# EAGLE design esp32-canbus (EAGLE 6.6.0)
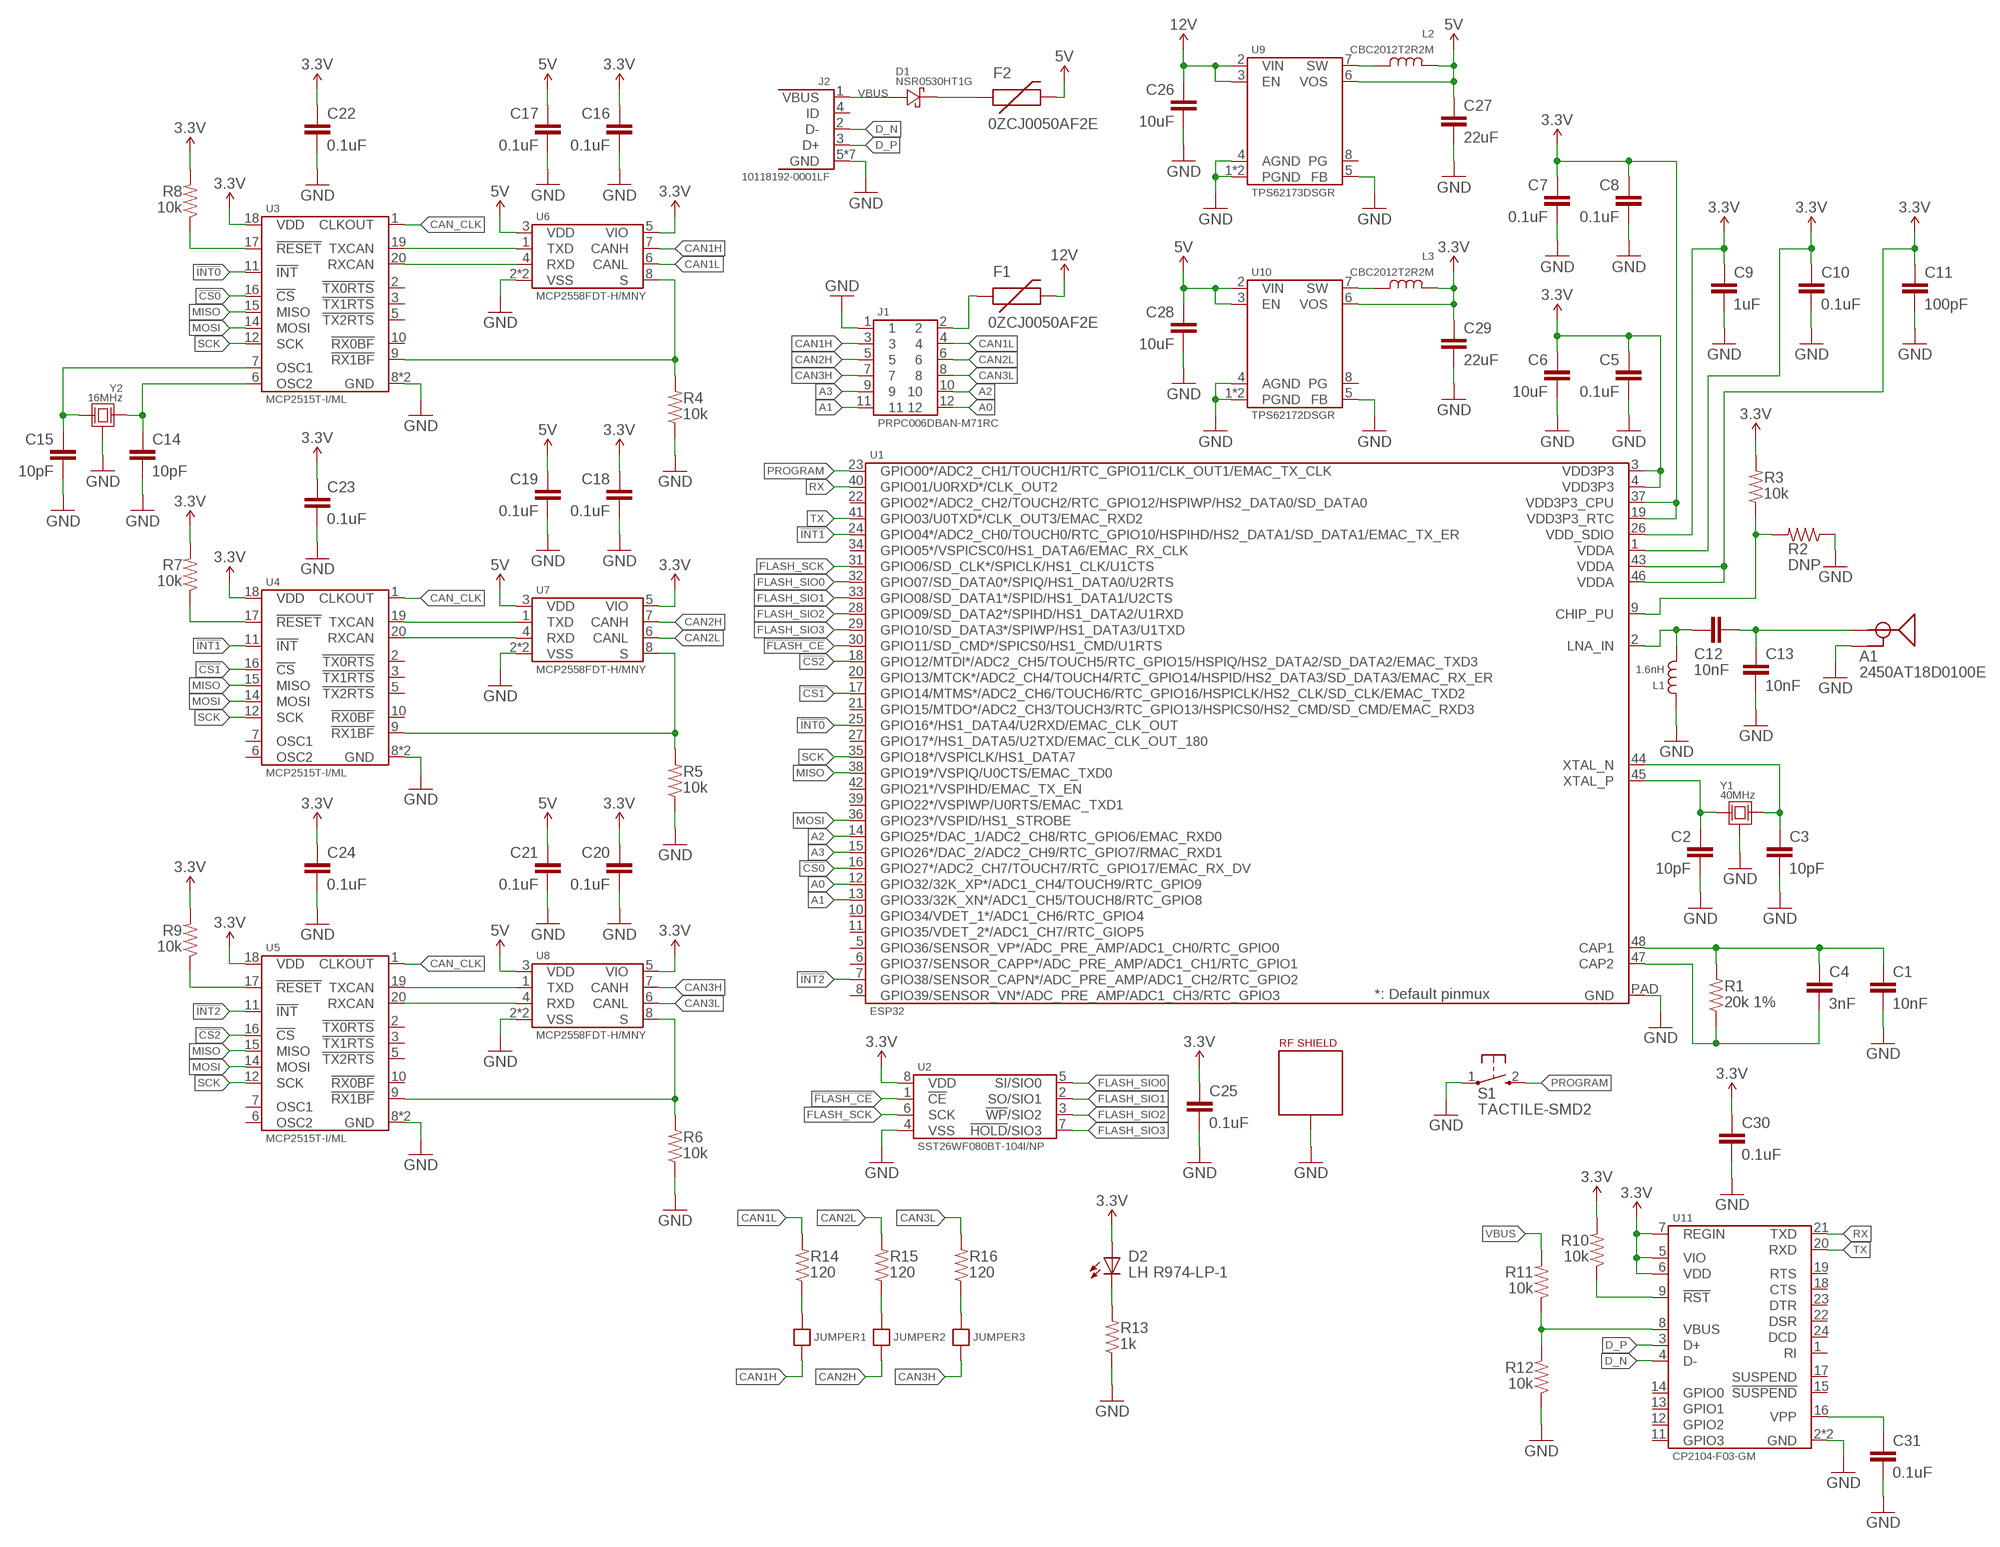
[diagram p0: schematic, sheet 1]

## Parts
A1  2450AT18D0100E  [4SMD-ANTENNA]
C1  10nF  CAP-0603  [0603-CAP]
C2  10pF  CAP-0603  [0603-CAP]
C3  10pF  CAP-0603  [0603-CAP]
C4  3nF  CAP-0603  [0603-CAP]
C5  0.1uF  CAP-0603  [0603-CAP]
C6  10uF  CAP-0603  [0603-CAP]
C7  0.1uF  CAP-0603  [0603-CAP]
C8  0.1uF  CAP-0603  [0603-CAP]
C9  1uF  CAP-0603  [0603-CAP]
C10  0.1uF  CAP-0603  [0603-CAP]
C11  100pF  CAP-0603  [0603-CAP]
C12  10nF  CAP-0603  [0603-CAP]
C13  10nF  CAP-0603  [0603-CAP]
C14  10pF  CAP-0603  [0603-CAP]
C15  10pF  CAP-0603  [0603-CAP]
C16  0.1uF  CAP-0603  [0603-CAP]
C17  0.1uF  CAP-0603  [0603-CAP]
C18  0.1uF  CAP-0603  [0603-CAP]
C19  0.1uF  CAP-0603  [0603-CAP]
C20  0.1uF  CAP-0603  [0603-CAP]
C21  0.1uF  CAP-0603  [0603-CAP]
C22  0.1uF  CAP-0603  [0603-CAP]
C23  0.1uF  CAP-0603  [0603-CAP]
C24  0.1uF  CAP-0603  [0603-CAP]
C25  0.1uF  CAP-0603  [0603-CAP]
C26  10uF  CAP-0603  [0603-CAP]
C27  22uF  CAP-0805  [0805-CAP]
C28  10uF  CAP-0603  [0603-CAP]
C29  22uF  CAP-0805  [0805-CAP]
C30  0.1uF  CAP-0603  [0603-CAP]
C31  0.1uF  CAP-0603  [0603-CAP]
D1  NSR0530HT1G  [SOD323]
D2  LH R974-LP-1  LED-0805  [0805-LED]
F1  0ZCJ0050AF2E  PTC-1206  [1206-PTC]
F2  0ZCJ0050AF2E  PTC-1206  [1206-PTC]
J1  PRPC006DBAN-M71RC  M06X2-100MIL-H  [M06X2-PTH-H]
J2  10118192-0001LF  USB-MICROB-3  [10118192-0001LF]
JUMPER1  JUMPER-NO  [JUMPER-NO]
JUMPER2  JUMPER-NO  [JUMPER-NO]
JUMPER3  JUMPER-NO  [JUMPER-NO]
L1  1.6nH  INDUCTOR-0402  [0402-INDUCTOR]
L2  CBC2012T2R2M  INDUCTOR-0805  [0805]
L3  CBC2012T2R2M  INDUCTOR-0805  [0805]
R1  20k 1%  RESISTOR-0603  [0603-CAP]
R2  DNP  RESISTOR-0603  [0603-CAP]
R3  10k  RESISTOR-0603  [0603-CAP]
R4  10k  RESISTOR-0603  [0603-CAP]
R5  10k  RESISTOR-0603  [0603-CAP]
R6  10k  RESISTOR-0603  [0603-CAP]
R7  10k  RESISTOR-0603  [0603-CAP]
R8  10k  RESISTOR-0603  [0603-CAP]
R9  10k  RESISTOR-0603  [0603-CAP]
R10  10k  RESISTOR-0603  [0603-CAP]
R11  10k  RESISTOR-0603  [0603-CAP]
R12  10k  RESISTOR-0603  [0603-CAP]
R13  1k  RESISTOR-0603  [0603-CAP]
R14  120  RESISTOR-0603  [0603-CAP]
R15  120  RESISTOR-0603  [0603-CAP]
R16  120  RESISTOR-0603  [0603-CAP]
S1  TACTILE-SMD2  [PTS820-J15M-SMTR-LFS]
SH1  BMI-S-102  RF-SHIELD  [RF_SHIELD-.65X.65]
U1  ESP32  [ESP32]
U2  SST26WF080BT-104I/NP  FLASH-USON  [USON-8-2X3]
U3  MCP2515T-I/ML  [VQFN-20-4MM]
U4  MCP2515T-I/ML  [VQFN-20-4MM]
U5  MCP2515T-I/ML  [VQFN-20-4MM]
U6  MCP2558FDT-H/MNY  [TDFN-8-2X3]
U7  MCP2558FDT-H/MNY  [TDFN-8-2X3]
U8  MCP2558FDT-H/MNY  [TDFN-8-2X3]
U9  TPS62173DSGR  [DFN-8-2MM]
U10  TPS62172DSGR  [DFN-8-2MM]
U11  CP2104-F03-GM  [QFN-24-4X4]
Y1  40MHz  CRYSTAL-3.2X2.5  [FA-238]
Y2  16MHz  CRYSTAL-3.2X2.5  [FA-238]

## Nets
3.3V: C5.1 C6.1 C7.1 C8.1 C9.1 C10.1 C11.1 C16.1 C18.1 C20.1 C22.1 C23.1 C24.1 C25.1 C29.1 C30.1 D2.A L3.2 R3.2 R7.2 R8.2 R9.2 R10.2 U1.1(VDDA) U1.3(VDD3P3) U1.4(VDD3P3) U1.19(VDD3P3_RTC) U1.26(VDD_SDIO) U1.37(VDD3P3_CPU) U1.43(VDDA) U1.46(VDDA) U2.8(VDD) U3.18(VDD) U4.18(VDD) U5.18(VDD) U6.5(VIO) U7.5(VIO) U8.5(VIO) U10.6(VOS) U11.5(VIO) U11.6(VDD) U11.7(REGIN)
5V: C17.1 C19.1 C21.1 C27.1 C28.1 F2.P$2 L2.2 U6.3(VDD) U7.3(VDD) U8.3(VDD) U9.6(VOS) U10.2(VIN) U10.3(EN)
12V: C26.1 F1.P$2 U9.2(VIN) U9.3(EN)
!CS0: U1.16(GPIO27*/ADC2_CH7/TOUCH7/RTC_GPIO17/EMAC_RX_DV) U3.16(!CS)
!CS1: U1.17(GPIO14/MTMS*/ADC2_CH6/TOUCH6/RTC_GPIO16/HSPICLK/HS2_CLK/SD_CLK/EMAC_TXD2) U4.16(!CS)
!CS2: U1.18(GPIO12/MTDI*/ADC2_CH5/TOUCH5/RTC_GPIO15/HSPIQ/HS2_DATA2/SD_DATA2/EMAC_TXD3) U5.16(!CS)
!FLASH_CE: U1.30(GPIO11/SD_CMD*/SPICS0/HS1_CMD/U1RTS) U2.1(!CE)
!INT0: U1.25(GPIO16*/HS1_DATA4/U2RXD/EMAC_CLK_OUT) U3.11(!INT)
!INT1: U1.24(GPIO04*/ADC2_CH0/TOUCH0/RTC_GPIO10/HSPIHD/HS2_DATA1/SD_DATA1/EMAC_TX_ER) U4.11(!INT)
!INT2: U1.7(GPIO38/SENSOR_CAPN*/ADC_PRE_AMP/ADC1_CH2/RTC_GPIO2) U5.11(!INT)
A0: J1.12 U1.12(GPIO32/32K_XP*/ADC1_CH4/TOUCH9/RTC_GPIO9)
A1: J1.11 U1.13(GPIO33/32K_XN*/ADC1_CH5/TOUCH8/RTC_GPIO8)
A2: J1.10 U1.14(GPIO25*/DAC_1/ADC2_CH8/RTC_GPIO6/EMAC_RXD0)
A3: J1.9 U1.15(GPIO26*/DAC_2/ADC2_CH9/RTC_GPIO7/RMAC_RXD1)
CAN1H: J1.3 JUMPER1.P$1 U6.7(CANH)
CAN1L: J1.4 R14.2 U6.6(CANL)
CAN2H: J1.5 JUMPER2.P$1 U7.7(CANH)
CAN2L: J1.6 R15.2 U7.6(CANL)
CAN3H: J1.7 JUMPER3.P$1 U8.7(CANH)
CAN3L: J1.8 R16.2 U8.6(CANL)
CAN_CLK: U3.1(CLKOUT) U4.1(CLKOUT) U5.1(CLKOUT)
D_N: J2.2(D-) U11.4(D-)
D_P: J2.3(D+) U11.3(D+)
FLASH_SCK: U1.31(GPIO06/SD_CLK*/SPICLK/HS1_CLK/U1CTS) U2.6(SCK)
FLASH_SIO0: U1.32(GPIO07/SD_DATA0*/SPIQ/HS1_DATA0/U2RTS) U2.5(SI/SIO0)
FLASH_SIO1: U1.33(GPIO08/SD_DATA1*/SPID/HS1_DATA1/U2CTS) U2.2(SO/SIO1)
FLASH_SIO2: U1.28(GPIO09/SD_DATA2*/SPIHD/HS1_DATA2/U1RXD) U2.3(!WP!/SIO2)
FLASH_SIO3: U1.29(GPIO10/SD_DATA3*/SPIWP/HS1_DATA3/U1TXD) U2.7(!HOLD!/SIO3)
GND: A1.2(GND) A1.3(GND) A1.4(GND) C1.2 C2.2 C3.2 C5.2 C6.2 C7.2 C8.2 C9.2 C10.2 C11.2 C13.2 C14.2 C15.2 C16.2 C17.2 C18.2 C19.2 C20.2 C21.2 C22.2 C23.2 C24.2 C25.2 C26.2 C27.2 C28.2 C29.2 C30.2 C31.2 J1.1 J2.5(GND) J2.P$6(GND) J2.P$7(GND) J2.P$8(GND) J2.P$9(GND) J2.P$10(GND) J2.P$11(GND) L1.1 R2.1 R4.1 R5.1 R6.1 R12.1 R13.1 S1.1 SH1.P$1 SH1.P$2 SH1.P$3 SH1.P$4 SH1.P$5 SH1.P$6 SH1.P$7 SH1.P$8 SH1.P$9 SH1.P$10 SH1.P$11 SH1.P$12 U1.PAD(GND) U2.4(VSS) U3.8(GND) U3.PAD(GND) U4.8(GND) U4.PAD(GND) U5.8(GND) U5.PAD(GND) U6.2(VSS) U6.PAD(VSS) U7.2(VSS) U7.PAD(VSS) U8.2(VSS) U8.PAD(VSS) U9.1(PGND) U9.4(AGND) U9.5(FB) U9.PAD(PGND) U10.1(PGND) U10.4(AGND) U10.5(FB) U10.PAD(PGND) U11.2(GND) U11.PAD(GND) Y1.2(GND) Y1.4(GND) Y2.2(GND) Y2.4(GND)
MISO: U1.38(GPIO19*/VSPIQ/U0CTS/EMAC_TXD0) U3.15(MISO) U4.15(MISO) U5.15(MISO)
MOSI: U1.36(GPIO23*/VSPID/HS1_STROBE) U3.14(MOSI) U4.14(MOSI) U5.14(MOSI)
N$1: C1.1 C4.1 R1.2 U1.48(CAP1)
N$2: C4.2 R1.1 U1.47(CAP2)
N$3: C3.1 U1.44(XTAL_N) Y1.3
N$4: C2.1 U1.45(XTAL_P) Y1.1
N$5: A1.1(SIGNAL) C12.2 C13.1
N$6: C12.1 L1.2 U1.2(LNA_IN)
N$7: R2.2 R3.1 U1.9(CHIP_PU)
N$8: U5.19(TXCAN) U8.1(TXD)
N$9: U5.20(RXCAN) U8.4(RXD)
N$10: R4.2 U3.9(!RX1BF) U6.8(S)
N$11: U3.20(RXCAN) U6.4(RXD)
N$12: U3.19(TXCAN) U6.1(TXD)
N$13: R5.2 U4.9(!RX1BF) U7.8(S)
N$14: U4.20(RXCAN) U7.4(RXD)
N$15: U4.19(TXCAN) U7.1(TXD)
N$16: R6.2 U5.9(!RX1BF) U8.8(S)
N$17: C15.1 U3.7(OSC1) Y2.3
N$18: C14.1 U3.6(OSC2) Y2.1
N$19: R7.1 U4.17(!RESET)
N$20: R9.1 U5.17(!RESET)
N$21: R8.1 U3.17(!RESET)
N$23: R11.1 R12.2 U11.8(VBUS)
N$24: L2.1 U9.7(SW)
N$25: L3.1 U10.7(SW)
N$26: F1.P$1 J1.2
N$27: R10.1 U11.9(!RST)
N$28: D1.C F2.P$1
N$29: D2.C R13.2
N$31: JUMPER1.P$2 R14.1
N$32: C31.1 U11.16(VPP)
N$34: JUMPER2.P$2 R15.1
N$35: JUMPER3.P$2 R16.1
PROGRAM: S1.2 U1.23(GPIO00*/ADC2_CH1/TOUCH1/RTC_GPIO11/CLK_OUT1/EMAC_TX_CLK)
RX: U1.40(GPIO01/U0RXD*/CLK_OUT2) U11.21(TXD)
SCK: U1.35(GPIO18*/VSPICLK/HS1_DATA7) U3.12(SCK) U4.12(SCK) U5.12(SCK)
TX: U1.41(GPIO03/U0TXD*/CLK_OUT3/EMAC_RXD2) U11.20(RXD)
VBUS: D1.A J2.1(VBUS) R11.2
Unconnected: J2.4(ID) U1.5(GPIO36/SENSOR_VP*/ADC_PRE_AMP/ADC1_CH0/RTC_GPIO0) U1.6(GPIO37/SENSOR_CAPP*/ADC_PRE_AMP/ADC1_CH1/RTC_GPIO1) U1.8(GPIO39/SENSOR_VN*/ADC_PRE_AMP/ADC1_CH3/RTC_GPIO3) U1.10(GPIO34/VDET_1*/ADC1_CH6/RTC_GPIO4) U1.11(GPIO35/VDET_2*/ADC1_CH7/RTC_GIOP5) U1.20(GPIO13/MTCK*/ADC2_CH4/TOUCH4/RTC_GPIO14/HSPID/HS2_DATA3/SD_DATA3/EMAC_RX_ER) U1.21(GPIO15/MTDO*/ADC2_CH3/TOUCH3/RTC_GPIO13/HSPICS0/HS2_CMD/SD_CMD/EMAC_RXD3) U1.22(GPIO02*/ADC2_CH2/TOUCH2/RTC_GPIO12/HSPIWP/HS2_DATA0/SD_DATA0) U1.27(GPIO17*/HS1_DATA5/U2TXD/EMAC_CLK_OUT_180) U1.34(GPIO05*/VSPICSC0/HS1_DATA6/EMAC_RX_CLK) U1.39(GPIO22*/VSPIWP/U0RTS/EMAC_TXD1) U1.42(GPIO21*/VSPIHD/EMAC_TX_EN) U3.2(!TX0RTS) U3.3(!TX1RTS) U3.5(!TX2RTS) U3.10(!RX0BF) U4.2(!TX0RTS) U4.3(!TX1RTS) U4.5(!TX2RTS) U4.6(OSC2) U4.7(OSC1) U4.10(!RX0BF) U5.2(!TX0RTS) U5.3(!TX1RTS) U5.5(!TX2RTS) U5.6(OSC2) U5.7(OSC1) U5.10(!RX0BF) U9.8(PG) U10.8(PG) U11.1(RI) U11.11(GPIO3) U11.12(GPIO2) U11.13(GPIO1) U11.14(GPIO0) U11.15(!SUSPEND) U11.17(SUSPEND) U11.18(CTS) U11.19(RTS) U11.22(DSR) U11.23(DTR) U11.24(DCD)

## Library data of the parts
A1 = Passives:2450AT18D0100E
C1-C31 = Passives:CAP
D1 = ON Semiconductor:NSR0530
D2 = Passives:LED
F1 F2 = Passives:PTC
J1 = Connectors:M06X2
J2 = Connectors:USB-MICROB
JUMPER1-JUMPER3 = Passives:JUMPER
L1-L3 = Passives:INDUCTOR
R1-R16 = Passives:RESISTOR
S1 = Passives:TACTILE
SH1 = Passives:RF-SHIELD
U1 = Espressif:ESP32
U2 = Microchip:FLASH
U3-U5 = Microchip:MCP2515
U6-U8 = Microchip:MCP2558FD
U9 U10 = TI:TPS6217
U11 = Silicon Labs:CP2104
Y1 Y2 = Passives:CRYSTAL

## Board
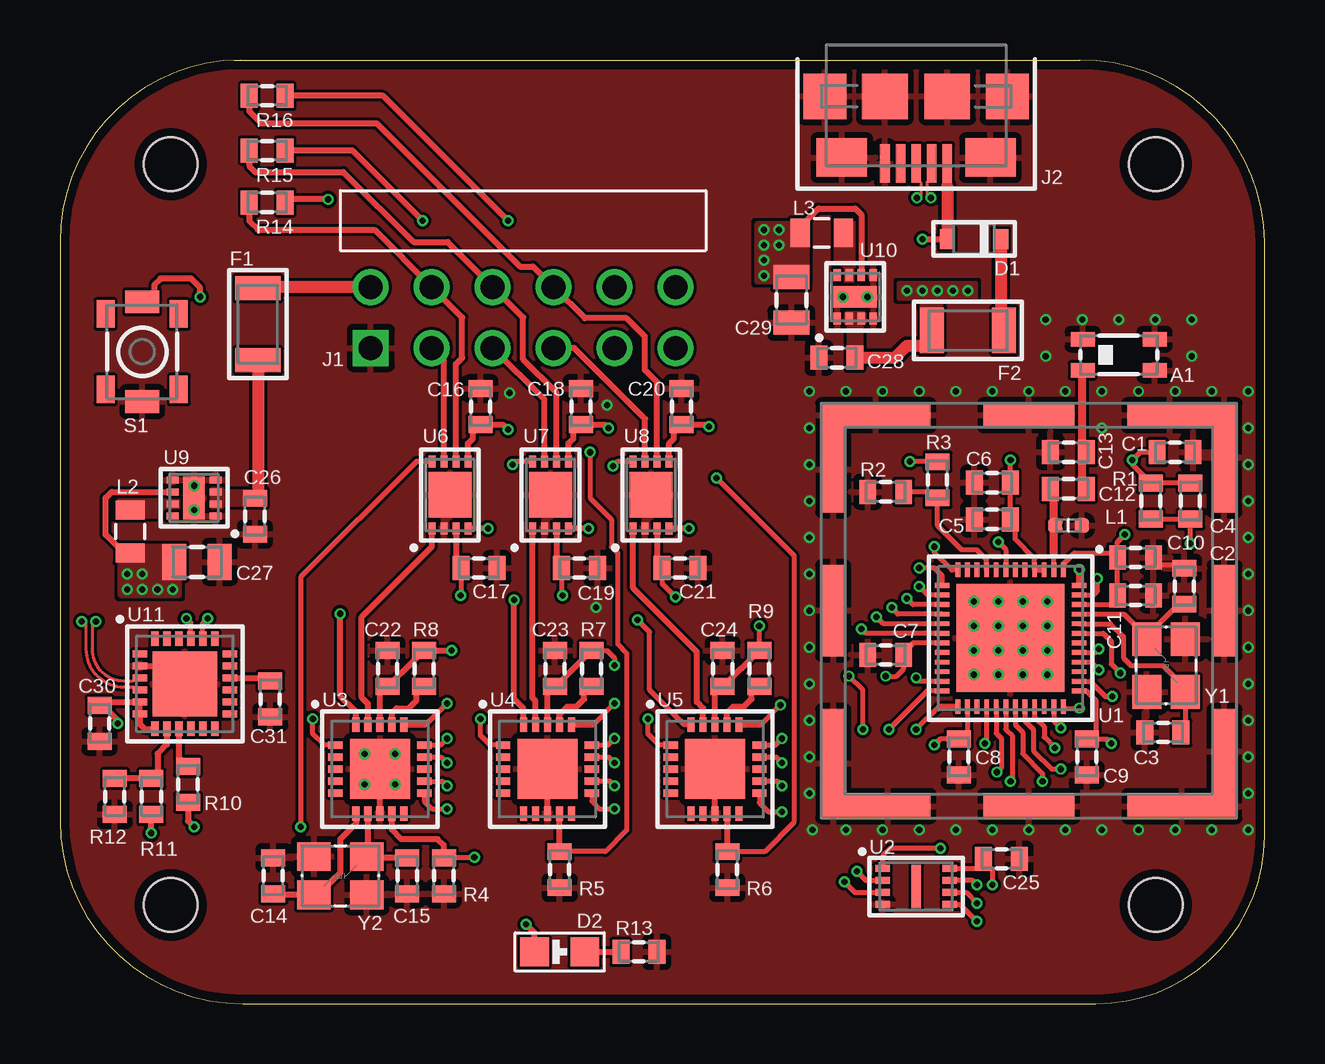
[diagram p1: board, top side]
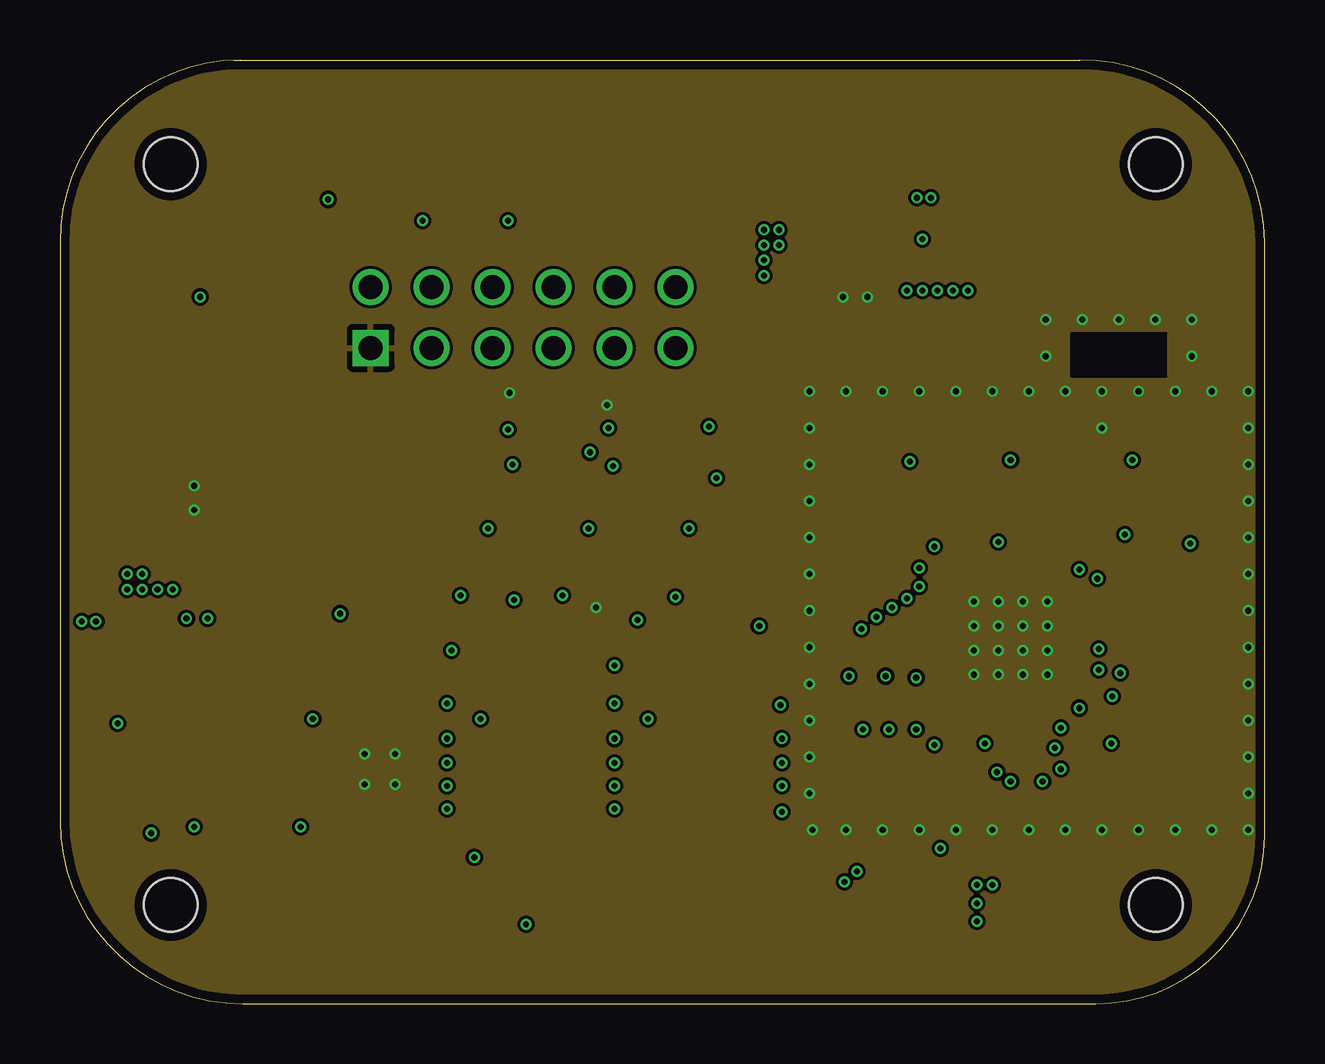
[diagram p2: board, inner layer Route2]
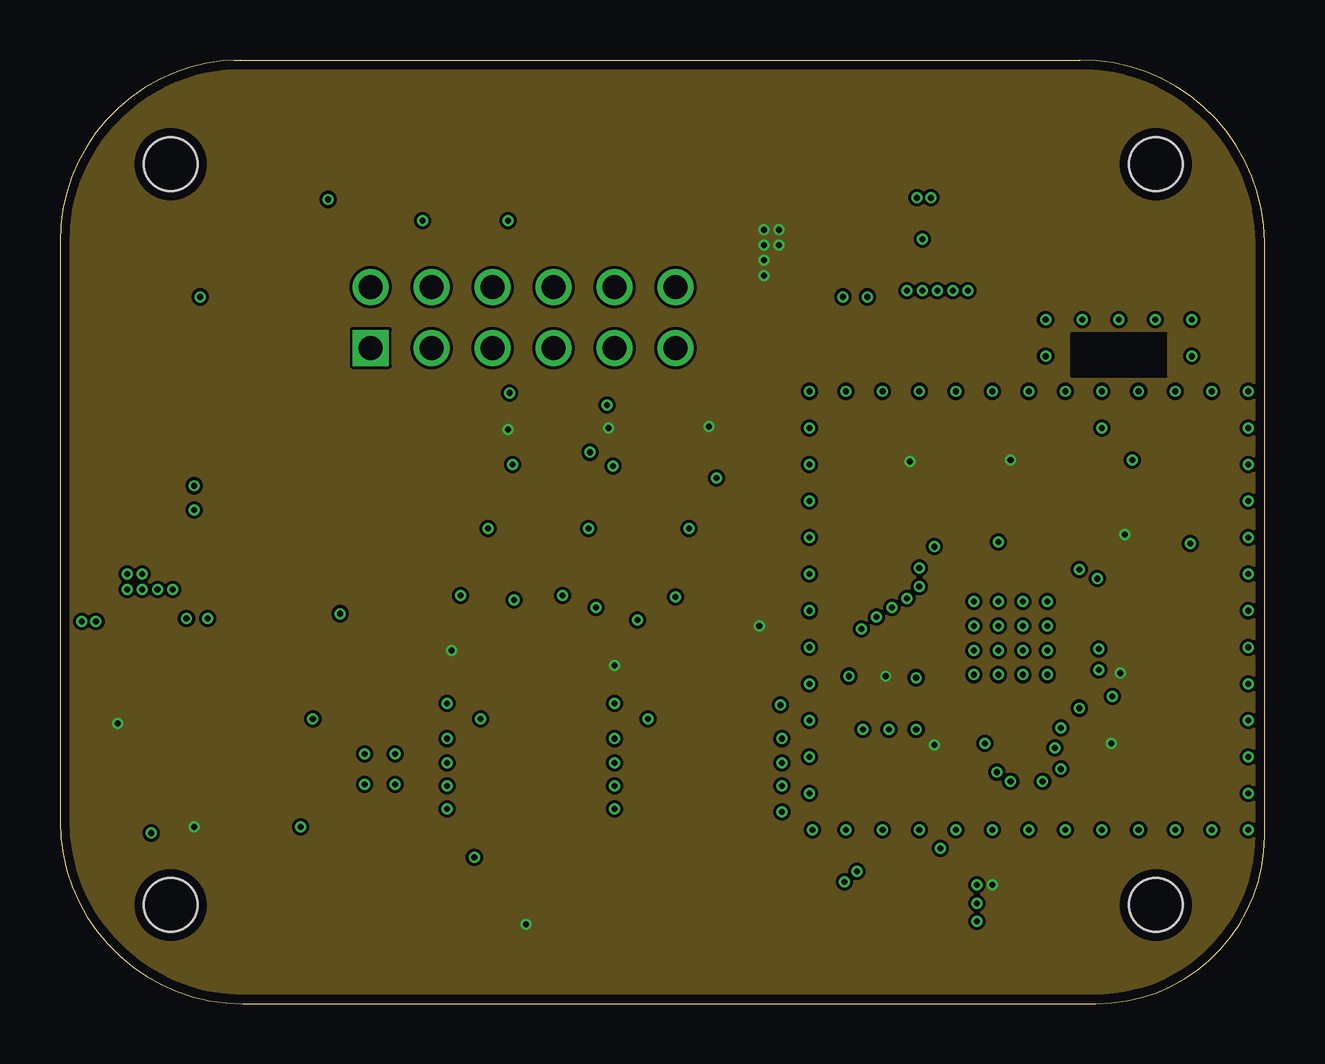
[diagram p3: board, inner layer Route15]
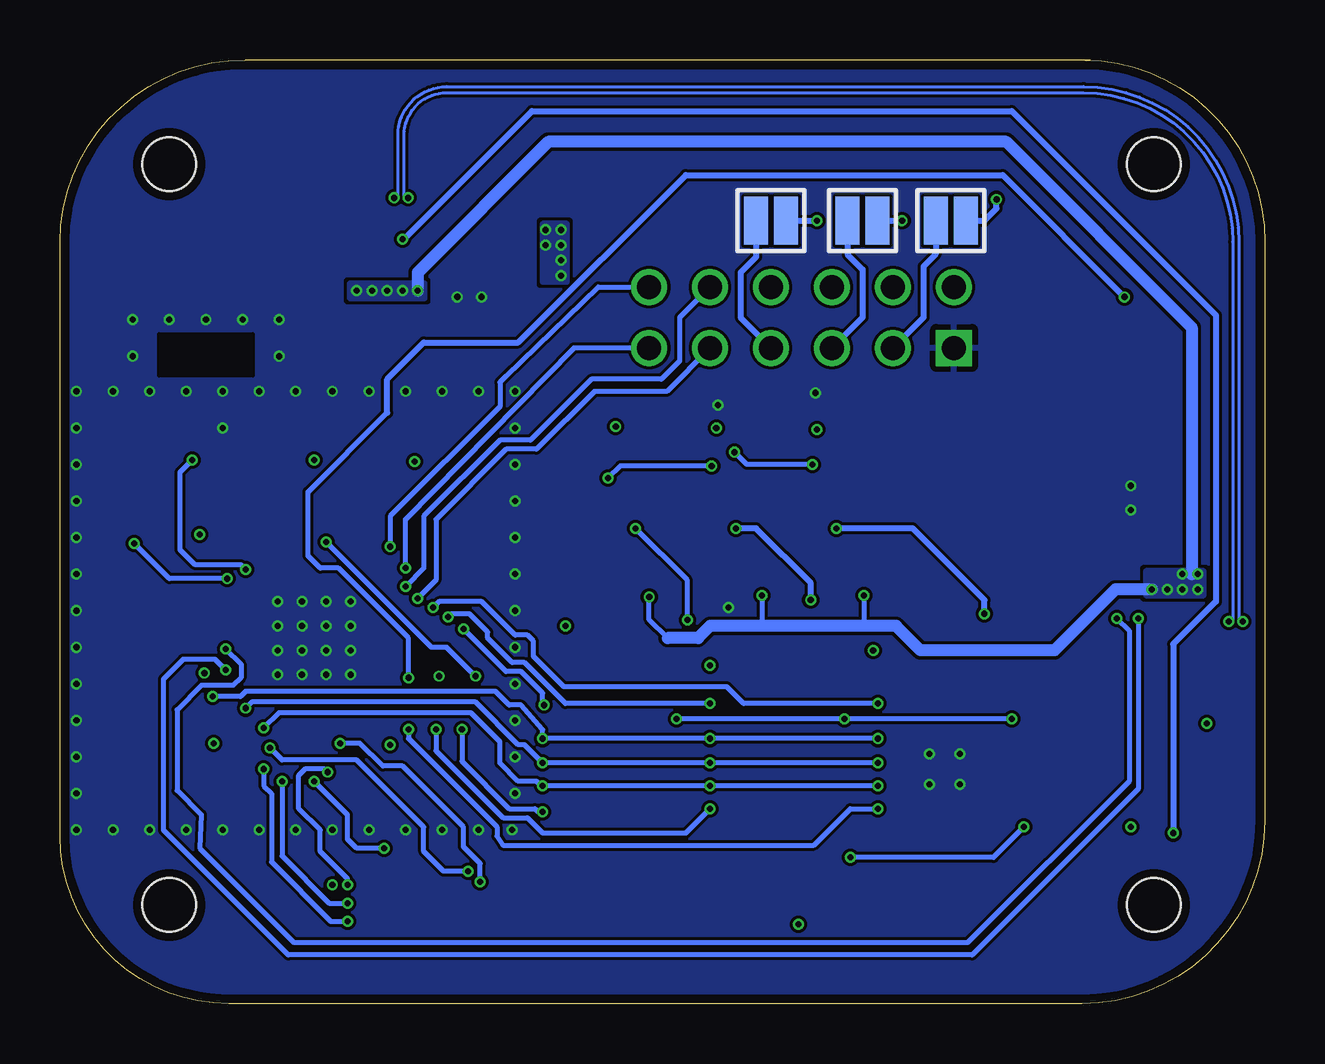
[diagram p4: board, bottom side, seen from below]

Size 50.22 x 39.34 mm. Coordinates in mm from the lower left corner, seen from the top.
Outline: 7.5,39.34 arc90 0,31.74 0,7.62 arc90 7.62,0 43.18,0 arc90 50.22,6.99 50.22,31.74 arc90 42.5,39.34 7.26,39.34
Copper layers (1*2*15*16): Top 0.035559375mm / dielectric 0.17018125mm / Route2 0.01778125mm / dielectric 47mil / Route15 0.01778125mm / dielectric 0.17018125mm / Bottom 0.035559375mm
Design rules "OSHPark-4layer *": minimum track width 5mil, minimum drill 10mil, track to track 5mil, track to pad 5mil, pad to pad 5mil, via to via 5mil, smd to smd 5mil, copper to edge 15mil, drill to drill 6mil, minimum pad ring 4mil, minimum via ring 4mil, stop-mask expansion 2.5mil, vias tented up to drill 20mil, thermal gap 10mil
Holes 2.24 mm at 4.62,35 45.67,4.11 4.62,4.11 45.67,35
tRestrict: 1 lines

### Footprints (pad centres in the part's own frame; a part is rotated, then mirrored left to right if it is on the bottom)
4SMD-ANTENNA = smd 1 x 0.6: 1 -1.5,-0.65; 2 -1.5,0.65; 3 1.5,0.65; 4 1.5,-0.65
0603-CAP = smd 0.7 x 1: 1 -0.75,0; 2 0.75,0
0805-CAP = smd 1 x 1.5: 1 -0.95,0; 2 0.95,0
SOD323 = smd 0.63 x 0.83: A 1.115,0; C -1.115,0
0805-LED = smd 1.2 x 1.2: A -1.05,0; C 1.05,0
1206-PTC = smd 1 x 1.9: P$1 1.5,0; P$2 -1.5,0
M06X2-PTH-H = drill 1 square: 1 -6.35,-1.27 | drill 1: 2 -6.35,1.27; 3 -3.81,-1.27; 4 -3.81,1.27; 5 -1.27,-1.27; 6 -1.27,1.27; 7 1.27,-1.27; 8 1.27,1.27; 9 3.81,-1.27; 10 3.81,1.27; 11 6.35,-1.27; 12 6.35,1.27
10118192-0001LF = smd 1.6 x 0.4: 1 -0.1,1.3; 2 -0.1,0.65; 3 -0.1,0; 4 -0.1,-0.65; 5 -0.1,-1.3 | smd 1.6 x 2.1: P$6 -0.35,-3.1; P$7 -0.35,3.1 | smd 1.9 x 1.9: P$8 -2.9,1.3; P$9 -2.9,-1.3 | smd 1.9 x 1.8: P$10 -2.9,3.8; P$11 -2.9,-3.8
JUMPER-NO = smd 1 x 2: P$1 -0.625,0; P$2 0.625,0
0402-INDUCTOR = smd 0.6 x 0.6: 1 -0.55,0; 2 0.55,0
0805 = smd 0.8 x 1.2: 1 -0.9,0; 2 0.9,0
PTS820-J15M-SMTR-LFS = smd 0.95 x 1.4: 1 -2.075,0; 2 2.075,0 | smd 1.15 x 0.75: P$3 1.575,1.525; P$4 1.575,-1.525; P$5 -1.575,-1.525; P$6 -1.575,1.525
RF_SHIELD-.65X.65 = smd 1 x 4.55: P$1 -8.15,-6.375; P$3 8.15,6.375 | smd 4.55 x 1: P$2 -6.375,8.15; P$4 6.375,-8.15 | smd 1 x 3.8: P$5 -8.15,0; P$6 8.15,0 | smd 3.8 x 1: P$7 0,8.15; P$8 0,-8.15 | smd 1 x 3.55: P$9 -8.15,5.875; P$11 8.15,-5.875 | smd 3.55 x 1: P$10 -5.875,-8.15; P$12 5.875,8.15
ESP32 = smd 0.6 x 0.2: 1 -2.85,2.2; 2 -2.85,1.8; 3 -2.85,1.4; 4 -2.85,1; 5 -2.85,0.6; 6 -2.85,0.2; 7 -2.85,-0.2; 8 -2.85,-0.6; 9 -2.85,-1; 10 -2.85,-1.4; 11 -2.85,-1.8; 12 -2.85,-2.2; 25 2.85,-2.2; 26 2.85,-1.8; 27 2.85,-1.4; 28 2.85,-1; 29 2.85,-0.6; 30 2.85,-0.2; 31 2.85,0.2; 32 2.85,0.6; 33 2.85,1; 34 2.85,1.4; 35 2.85,1.8; 36 2.85,2.2 | smd 0.2 x 0.6: 13 -2.2,-2.85; 14 -1.8,-2.85; 15 -1.4,-2.85; 16 -1,-2.85; 17 -0.6,-2.85; 18 -0.2,-2.85; 19 0.2,-2.85; 20 0.6,-2.85; 21 1,-2.85; 22 1.4,-2.85; 23 1.8,-2.85; 24 2.2,-2.85; 37 2.2,2.85; 38 1.8,2.85; 39 1.4,2.85; 40 1,2.85; 41 0.6,2.85; 42 0.2,2.85; 43 -0.2,2.85; 44 -0.6,2.85; 45 -1,2.85; 46 -1.4,2.85; 47 -1.8,2.85; 48 -2.2,2.85 | smd 4.5 x 4.5: PAD 0,0
USON-8-2X3 = smd 0.6 x 0.3: 1 -1.4,0.75; 2 -1.4,0.25; 3 -1.4,-0.25; 4 -1.4,-0.75; 5 1.4,-0.75; 6 1.4,-0.25; 7 1.4,0.25; 8 1.4,0.75 | smd 0.4 x 1.8: P$1 0,0
VQFN-20-4MM = smd 0.6 x 0.3: 1 -1.85,1; 2 -1.85,0.5; 3 -1.85,0; 4 -1.85,-0.5; 5 -1.85,-1; 11 1.85,-1; 12 1.85,-0.5; 13 1.85,0; 14 1.85,0.5; 15 1.85,1 | smd 0.3 x 0.6: 6 -1,-1.85; 7 -0.5,-1.85; 8 0,-1.85; 9 0.5,-1.85; 10 1,-1.85; 16 1,1.85; 17 0.5,1.85; 18 0,1.85; 19 -0.5,1.85; 20 -1,1.85 | smd 2.5 x 2.5: PAD 0,0
TDFN-8-2X3 = smd 0.5 x 0.3: 1 -1.4,0.75; 2 -1.4,0.25; 3 -1.4,-0.25; 4 -1.4,-0.75; 5 1.4,-0.75; 6 1.4,-0.25; 7 1.4,0.25; 8 1.4,0.75 | smd 1.9 x 1.8: PAD 0,0
DFN-8-2MM = smd 0.5 x 0.3: 1 -0.9,0.75; 2 -0.9,0.25; 3 -0.9,-0.25; 4 -0.9,-0.75; 5 0.9,-0.75; 6 0.9,-0.25; 7 0.9,0.25; 8 0.9,0.75 | smd 0.9 x 1.8: PAD 0,0
QFN-24-4X4 = smd 0.6 x 0.3: 1 -1.875,1.25; 2 -1.875,0.75; 3 -1.875,0.25; 4 -1.875,-0.25; 5 -1.875,-0.75; 6 -1.875,-1.25; 13 1.875,-1.25; 14 1.875,-0.75; 15 1.875,-0.25; 16 1.875,0.25; 17 1.875,0.75; 18 1.875,1.25 | smd 0.3 x 0.6: 7 -1.25,-1.875; 8 -0.75,-1.875; 9 -0.25,-1.875; 10 0.25,-1.875; 11 0.75,-1.875; 12 1.25,-1.875; 19 1.25,1.875; 20 0.75,1.875; 21 0.25,1.875; 22 -0.25,1.875; 23 -0.75,1.875; 24 -1.25,1.875 | smd 2.7 x 2.7: PAD 0,0
FA-238 = smd 1.4 x 1.2: 1 -1.1,-0.8; 2 1.1,-0.8; 3 1.1,0.8; 4 -1.1,0.8

### Placement (x,y rotation side)
A1  44.13,27.05 0 top
C1  46.48,22.99 0 top
C2  46.86,17.4 90 top
C3  45.97,11.3 180 top
C4  47.12,20.95 270 top
C5  38.86,20.19 180 top
C6  38.86,21.72 180 top
C7  34.42,14.54 180 top
C8  37.47,10.29 270 top
C9  42.8,10.29 270 top
C10  44.83,18.61 0 top
C11  44.83,17.02 0 top
C12  42.04,21.46 0 top
C13  42.04,22.99 180 top
C14  8.89,5.33 90 top
C15  14.48,5.33 270 top
C16  17.53,24.89 90 top
C17  17.46,18.16 0 top
C18  21.72,24.89 90 top
C19  21.65,18.16 0 top
C20  25.91,24.89 90 top
C21  25.84,18.16 0 top
C22  13.65,13.97 90 top
C23  20.64,13.97 90 top
C24  27.62,13.97 90 top
C25  39.24,6.03 0 top
C26  8.13,20.32 270 top
C27  5.71,18.41 0 top
C28  32.38,26.92 180 top
C29  30.48,29.34 270 top
C30  1.65,11.68 270 top
C31  8.76,12.7 270 top
D1  38.1,31.88 180 top
D2  20.83,2.16 0 top
F1  8.26,28.32 90 top
F2  37.85,28.07 0 top
J1  19.3,28.61 0 top
J2  35.69,34.92 270 top
JUMPER1  13.08,32.64 0 bottom
JUMPER2  16.76,32.64 0 bottom
JUMPER3  20.57,32.64 0 bottom
L1  42.04,19.94 180 top
L2  2.92,19.68 270 top
L3  31.75,32.13 180 top
R1  45.47,20.95 90 top
R2  34.42,21.34 0 top
R3  36.58,21.84 90 top
R4  16,5.33 90 top
R5  20.83,5.59 90 top
R6  27.81,5.59 90 top
R7  22.16,13.97 90 top
R8  15.18,13.97 90 top
R9  29.15,13.97 90 top
R10  5.33,9.14 270 top
R11  3.81,8.64 270 top
R12  2.29,8.64 90 top
R13  24.13,2.16 180 top
R14  8.64,33.4 180 top
R15  8.64,35.56 180 top
R16  8.64,37.85 180 top
S1  3.43,27.18 90 top
SH1  40.39,16.38 270 top
U1  39.62,15.24 270 top
U2  35.69,4.89 0 top
U3  13.34,9.78 0 top
U4  20.32,9.78 0 top
U5  27.3,9.78 0 top
U6  16.26,21.21 90 top
U7  20.45,21.21 90 top
U8  24.64,21.21 90 top
U9  5.59,21.08 180 top
U10  33.15,29.46 90 top
U11  5.21,13.34 0 top
Y1  46.1,14.1 270 top
Y2  11.68,5.33 0 top

### Tracks (layer width: path | path; a pad name or v marks a point on that pad's centre or on a via)
3.3V  (via drill 0.25)
  Top 0.203: U1.26 37.82,11.04 C8.1 36.69,11.04 v36.45,10.79 | U1.46 44.08,16.64 C11.1 C10.1 44.08,18.8 | U1.1 41.82,18.33 42.29,18.8 44.08,18.8 | 39.86,19.94 C5.1 | C5.1 C6.1 39.61,22.66 v39.62,22.67 | U1.19 35.56,15.04 35.17,14.64 C7.1 35.17,13.96 34.86,13.65 v34.42,13.65 | U1.37 42.78,13.04 43.18,12.64 43.18,11.04 | 43.18,11.04 C9.1 | U1.3 U1.4 40.62,18.56 39.81,19.37 39.81,19.99 C5.1 | 44.08,18.8 44.08,19.25 v44.39,19.56 | U1.43 43.48,15.44 43.81,15.11 43.81,14.16 v44.2,13.78 | 43.18,11.04 43.64,11.04 v43.81,10.86 | R3.2 35.45,22.59 v35.43,22.61 | R9.2 v29.15,15.75 | U2.8 38.49,5.64 C25.1 38.49,5.96 38.86,5.59 v38.86,4.95 | R7.2 22.8,14.72 23.11,14.41 v23.11,14.1
  Top 0.254: L3.2 30.85,32.37 31.62,33.15 33.15,33.15 33.4,32.9 U10.6 | U3.18 13.34,13.22 C22.1 13.66,13.22 14.73,14.29 14.74,14.29 R8.2 16.31,14.72 v16.32,14.73 | U5.18 27.3,13.22 C24.1 27.63,13.22 28.38,13.97 28.4,13.97 R9.2 | U4.18 20.32,13.22 C23.1 21.59,14.16 21.6,14.16 R7.2 | U6.5 17.01,23.36 17.21,23.56 17.21,23.82 C16.1 18.47,24.14 v18.67,23.94 | U7.5 21.2,23.36 21.4,23.56 21.4,23.82 C18.1 22.72,24.14 v22.86,24 | U8.5 25.39,23.36 25.59,23.56 25.59,23.82 C20.1 26.98,24.14 v27.05,24.07 | U11.7 3.53,11.46 3.33,11.65 U11.6 U11.5 1.68,12.59 C30.1 | R10.2 5.33,7.62 v5.59,7.37 | C30.1 1.51,12.56 | v2.41,11.68 2.41,11.81 1.79,12.43 C30.1 | D2.A 19.78,2.96 v19.43,3.3
  other vias: 29.34,32.26 29.34,31.62 29.34,30.99 29.97,31.62 29.97,32.26 29.34,30.35
  pour Top (no thermals): 31.11,32.51 31.11,30.1 29.08,30.1 29.08,32.51
  pour Bottom (no thermals): 30.1,32.51 30.1,30.1 29.08,30.1 29.08,32.51
  pour Route15 (rank 2): 7.62,0 arc-90 0,7.62 0,31.81 arc-90 7.53,39.34 42.55,39.34 arc-90 50.22,31.67 50.22,6.99 arc-90 43.23,0
5V  (via drill 0.25)
  Top 0.203: C21.1 25.09,17.51 v25.65,16.95 | C19.1 20.9,17.07 v20.95,17.02 | C17.1 16.71,17.03 v16.7,17.02
  Top 0.254: L2.2 2.68,18.79 1.91,19.56 1.91,21.08 2.16,21.34 U9.6 | U7.3 20.7,18.16 C19.1 | U8.3 24.89,18.16 C21.1 | U6.3 16.51,18.16 C17.1
  Top 0.508: C28.1 34.8,26.92 35.31,27.43 36.35,27.43 F2.P$2
  Bottom 0.203: v16.7,17.02 16.7,15.81 16.64,15.75 | v20.95,17.02 20.95,15.75 | 24.89,15.24 25.65,16 v25.65,16.95
  Bottom 0.508: v4.7,17.27 6.22,17.27 8.76,14.73 14.35,14.73 15.37,15.75 16.64,15.75 20.95,15.75 23.11,15.75 23.62,15.24 24.89,15.24 | 3.05,17.91 3.05,28.19 10.78,35.92 29.86,35.92 35.31,30.48 v35.31,29.72
  other vias: 2.79,17.91 3.43,17.91 3.43,17.27 2.79,17.27 4.06,17.27 36.58,29.72 37.85,29.72 35.94,29.72 37.21,29.72
  pour Top (no thermals): 2.54,19.05 4.95,19.05 4.95,17.02 2.54,17.02
  pour Top (no thermals): 33.4,26.61 33.4,28.38 33.53,28.38 33.53,28.77 32.77,28.77 32.77,28.38 32.89,28.38 32.89,26.61
  pour Top (no thermals): 36,27.24 35.94,29.4 34.99,29.4 34.99,30.04 38.16,30.04 38.16,29.4 36.7,29.4 36.7,27.24
  pour Bottom (no thermals): 2.54,18.03 4.95,18.03 4.95,17.02 2.54,17.02
  pour Bottom (no thermals): 34.99,29.4 34.99,30.04 38.16,30.04 38.16,29.4
12V
  Top 0.508: F1.P$2 8.26,21.2 C26.1
  pour Top (no thermals): 8.51,21.34 6.73,21.34 6.73,21.46 6.35,21.46 6.35,20.7 6.73,20.7 6.73,20.83 8.51,20.83
!CS0  (via drill 0.25)
  Top 0.203: U1.16 34.92,16.24 34.67,16.49 v34.67,16.51 | U3.16 15.25,11.63 v16.13,12.51
  Bottom 0.203: v16.13,12.51 21.72,12.51 22.42,13.21 29.21,13.21 30.48,14.48 30.48,15.11 30.73,15.37 31.24,15.37 32.64,16.76 34.42,16.76 v34.67,16.51
!CS1  (via drill 0.25)
  Top 0.203: U1.17 34.33,15.84 v34.04,16.13 | U4.16 22.23,11.63 v23.11,12.51
  Bottom 0.203: v23.11,12.51 29.15,12.51 30.86,14.22 31.37,14.22 32.38,15.24 32.38,15.49 33.15,16.26 33.91,16.26 v34.04,16.13
!CS2  (via drill 0.25)
  Top 0.203: 33.53,15.49 v33.4,15.62 33.58,15.44 U1.18 | U5.16 29.22,11.63 v30.04,12.45
  Bottom 0.203: v30.04,12.45 30.1,12.45 30.1,12.95 30.99,13.84 31.62,13.84 v33.4,15.62
!FLASH_CE  (via drill 0.25)
  Top 0.203: U1.30 39.42,11.44 39.69,11.18 39.69,9.34 v39.62,9.27 | v36.7,6.48 34.61,6.48 34.29,6.16 U2.1
  Bottom 0.203: v36.7,6.48 37.85,6.48 38.23,6.86 38.23,7.87 v39.62,9.27
!INT0  (via drill 0.25)
  Top 0.203: U3.11 15.19,8.44 15.49,8.13 v16.13,8.13 | U1.25 36.65,12.39 v35.69,11.43
  Bottom 0.203: v35.69,11.43 35.69,11.05 32,7.37 32,6.99 31.75,6.6 18.8,6.6 17.27,8.13 v16.13,8.13
!INT1  (via drill 0.25)
  Top 0.203: U4.11 22.17,8.44 22.48,8.13 v23.11,8.13 | U1.24 36.15,13.04 v34.54,11.43
  Bottom 0.203: v34.54,11.43 34.54,10.54 31.75,7.75 30.73,7.75 30.1,7.11 24.13,7.11 v23.11,8.13
!INT2  (via drill 0.25)
  Top 0.203: U5.11 29.16,8.37 29.53,8 v30.1,8 | v33.47,11.43 33.47,13.08 v32.89,13.65 | v39.12,19.24 39.42,18.93 U1.7
  Bottom 0.203: v33.47,11.43 33.47,10.1 31.49,8.13 30.41,8.13 30.29,8 v30.1,8 | v32.89,13.65 34.1,14.86 34.73,14.86 v39.12,19.24
A0  (via drill 0.25)
  Top 0.203: v36.45,19.05 36.45,18.8 37.17,18.07 37.42,18.07 U1.12
  Bottom 0.203: J1.12 27.78,29.88 31.62,26.16 31.88,25.91 31.88,24.89 36.45,20.32 v36.45,19.05
A1  (via drill 0.25)
  Top 0.203: U1.13 36.77,17.84 36.45,18.16 v35.81,18.16
  Bottom 0.203: v35.81,18.16 35.81,20.19 28.8,27.34 J1.11
A2  (via drill 0.25)
  Top 0.203: U1.14 36.17,17.04 v35.81,17.4
  Bottom 0.203: J1.10 24.38,28.61 24.38,26.8 25.15,26.04 28.07,26.04 30.61,23.5 31.88,23.5 35.05,20.32 35.05,18.16 v35.81,17.4
A3  (via drill 0.25)
  Top 0.203: U1.15 35.56,16.64 v35.31,16.89
  Bottom 0.203: J1.9 24.92,25.53 27.94,25.53 30.35,23.11 31.62,23.11 34.54,20.19 34.54,17.65 v35.31,16.89
CAN1H
  Top 0.254: U6.7 16.01,26.82 J1.3
  Bottom 0.254: JUMPER1.P$1 13.71,31.25 14.22,30.73 14.22,28.61 J1.3
CAN1L
  Top 0.254: U6.6 16.51,26.67 16.76,26.92 16.76,28.61 J1.4 13.11,32.26 8.26,32.26 7.89,32.63 R14.2
CAN2H
  Top 0.254: U7.7 20.2,25.17 J1.5
  Bottom 0.254: JUMPER2.P$1 17.39,31.23 16.76,30.61 16.76,28.61 J1.5
CAN2L
  Top 0.254: U7.6 20.7,25.47 19.3,26.86 19.3,28.61 J1.6 16.16,31.75 14.73,31.75 11.81,34.67 8.13,34.67 7.89,34.91 R15.2
CAN3H
  Top 0.254: U8.7 24.39,24.38 21.43,27.34 J1.7
  Bottom 0.254: JUMPER3.P$1 21.2,31.12 21.84,30.48 21.84,28.61 J1.7
CAN3L
  Top 0.254: U8.6 24.89,25.91 24.38,26.42 24.38,27.81 23.62,28.57 21.88,28.57 J1.8 19.72,30.73 19.18,30.73 13.21,36.7 8.38,36.7 7.89,37.2 R16.2
CAN_CLK  (via drill 0.25)
  Top 0.203: U3.1 11,10.78 10.54,11.24 v10.54,11.87 | U5.1 24.97,10.78 24.51,11.24 v24.51,11.87 | U4.1 17.92,10.78 17.53,11.18 v17.53,11.87
  Bottom 0.203: v10.54,11.87 v17.53,11.87 v24.51,11.87
D_N  (via drill 0.25)
  Top 0.127: J2.2 36.34,34.43 36.13,34.23 36.13,33.59 v36.3,33.59 | v0.91,15.94 1.08,15.94 1.08,14.8 arc90 2.67,13.21 3.05,13.21 3.17,13.09 U11.4
  Bottom 0.127: v36.3,33.59 36.13,33.59 36.13,36.2 arc90 34.1,38.23 7.56,38.23 arc90 1.08,31.75 1.08,15.94 v0.91,15.94
D_P  (via drill 0.25)
  Top 0.127: J2.3 35.69,34.42 35.88,34.23 35.88,33.59 v35.71,33.59 | v1.5,15.94 1.33,15.94 1.33,14.8 arc90 2.67,13.46 3.05,13.46 3.17,13.59 U11.3
  Bottom 0.127: v35.71,33.59 35.88,33.59 35.88,36.2 arc90 34.1,37.97 7.56,37.97 arc90 1.33,31.75 1.33,15.94 v1.5,15.94
FLASH_SCK  (via drill 0.25)
  Top 0.203: U1.31 39.82,11.61 40.13,11.3 40.13,10.41 40.96,9.59 v40.96,9.27 | U2.6 37.78,4.64 v38.23,4.19
  Bottom 0.203: v40.96,9.27 40.96,6.16 38.99,4.19 v38.23,4.19
FLASH_SIO0  (via drill 0.25)
  Top 0.203: U1.32 40.22,11.78 40.58,11.43 40.58,10.54 41.34,9.78 v41.72,9.78 | U2.5 37.52,4.14 v38.23,3.43
  Bottom 0.203: v38.23,3.43 38.92,3.43 41.4,5.91 41.4,8.76 41.72,9.08 v41.72,9.78
FLASH_SIO1  (via drill 0.25)
  Top 0.203: U1.33 40.62,11.95 41.02,11.56 41.02,11.11 v41.47,10.67 | v33.21,5.52 33.6,5.14 U2.2
  Bottom 0.203: v33.21,5.52 34.23,5.52 35.05,6.35 35.05,7.37 37.85,10.16 40.96,10.16 v41.47,10.67
FLASH_SIO2  (via drill 0.25)
  Top 0.203: U1.28 38.62,10.94 v38.54,10.86 | v32.7,5.08 33.14,4.64 U2.3
  Bottom 0.203: v32.7,5.08 32.7,5.84 33.4,6.54 33.4,7.37 35.94,9.91 36.77,9.91 37.72,10.86 v38.54,10.86
FLASH_SIO3  (via drill 0.25)
  Top 0.203: U1.29 39.02,11.27 39.24,11.05 39.24,9.84 v39.05,9.65 | v38.23,4.95 38.04,5.14 U2.7
  Bottom 0.203: v39.05,9.65 39.18,9.78 40.01,9.78 40.26,9.53 40.26,8.13 39.37,7.24 39.37,6.35 38.23,5.21 v38.23,4.95
GND  (via drill 0.25)
  Top 0.203: v13.97,9.14 13.46,9.14 13.34,9.27 | v12.7,9.14 U3.PAD | v12.7,10.41 U3.PAD | v13.97,10.41 U3.PAD | v40.13,13.72 v39.12,13.72 v38.1,13.72 v38.1,14.73 | 41.27,13.72 v41.15,13.72 v41.15,14.73 | v41.15,14.73 v40.13,14.73 v39.12,14.73 v38.1,14.73 | v38.1,14.73 v38.1,15.75 | v40.13,15.75 v39.12,15.75 v38.1,16.76 v39.12,16.76 v40.13,16.76 40.64,16.26 | U1.PAD 40.64,15.24 | 40.64,15.24 v41.15,15.75 | 40.64,15.24 40.64,16.26 | 40.64,16.26 v41.15,16.76 | v41.15,14.73 40.64,15.24 | C2.2 46.72,18.29 45.9,18.29 C10.2
  Top 0.254: U4.8 U4.PAD | U5.8 U5.PAD | U3.8 13.34,9.27 U3.PAD | U11.2 4.46,14.09 U11.PAD
  other vias: 5.59,21.59 5.59,20.57 32.64,29.46 33.66,29.46 22.8,24.96 18.73,25.46 22.35,16.51 44.96,7.24 46.48,7.24 48.01,7.24 49.53,7.24 49.53,8.76 49.53,10.29 49.53,11.81 49.53,13.34 49.53,14.86 49.53,16.38 49.53,17.91 49.53,19.43 49.53,20.95 49.53,22.48 49.53,24 43.43,7.24 41.91,7.24 40.39,7.24 38.86,7.24 37.34,7.24 35.81,7.24 34.29,7.24 32.77,7.24 31.24,8.76 31.24,10.29 31.24,11.81 31.24,13.34 31.24,14.86 31.24,16.38 31.24,17.91 31.24,19.43 31.24,20.95 31.24,22.48 31.24,24 31.24,25.53 31.37,7.24 49.53,25.53 48.01,25.53 46.48,25.53 44.96,25.53 43.43,25.53 41.91,25.53 40.39,25.53 38.86,25.53 37.34,25.53 35.81,25.53 34.29,25.53 32.77,25.53 45.66,28.51 44.13,28.51 47.18,28.51 42.61,28.51 41.08,28.51 41.08,26.99 47.18,26.99 43.43,24
  pour Top (rank 2): 7.62,0 arc-90 0,7.62 0,31.81 arc-90 7.53,39.34 42.55,39.34 arc-90 50.22,31.67 50.22,6.99 arc-90 43.23,0
  pour Bottom (rank 2): 7.62,0 arc-90 0,7.62 0,31.81 arc-90 7.53,39.34 42.55,39.34 arc-90 50.22,31.67 50.22,6.99 arc-90 43.23,0
  pour Route2 (rank 2): 7.62,0 arc-90 0,7.62 0,31.81 arc-90 7.53,39.34 42.55,39.34 arc-90 50.22,31.67 50.22,6.99 arc-90 43.23,0
MISO  (via drill 0.25)
  Top 0.203: U1.38 42.95,13.44 43.58,12.8 v43.86,12.8 | U3.15 15.2,10.79 15.88,10.79 v16.13,11.05 | U4.15 22.84,10.78 v23.11,11.05 | U5.15 29.83,10.78 v30.1,11.05
  Bottom 0.203: v16.13,11.05 v23.11,11.05 v30.1,11.05 30.1,11.43 30.99,12.45 31.5,12.45 32.07,13.02 42.48,13.02 42.69,12.8 v43.86,12.8
MOSI  (via drill 0.25)
  Top 0.203: U1.36 41.82,12.32 v42.48,12.32 | U3.14 15.88,10.29 v16.13,10.03 | U4.14 22.87,10.28 v23.11,10.03 | U5.14 29.85,10.28 v30.1,10.03
  Bottom 0.203: v16.13,10.03 v23.11,10.03 v30.1,10.03 30.86,10.79 31.11,10.79 32.89,12.57 42.23,12.57 v42.48,12.32
N$1  (via drill 0.25)
  Top 0.203: U1.48 42.47,17.9 v42.48,18.1 | C1.1 45.02,22.99 v44.7,22.67 44.7,22.47 R1.2 C4.1
  Bottom 0.203: v42.48,18.1 42.67,18.29 44.58,18.29 45.21,18.92 45.21,22.16 v44.7,22.67
N$2  (via drill 0.25)
  Top 0.203: U1.47 43.08,17.04 43.24,17.21 v43.24,17.72 | v47.12,19.18 C4.2 R1.1
  Bottom 0.203: v43.24,17.72 45.66,17.72 v47.12,19.18
N$3
  Top 0.203: U1.44 43.79,15.84 44.32,15.3 44.32,14.41 44.64,14.1 45.97,14.1 46.61,13.46 46.61,13.29 Y1.3 46.9,11.48 C3.1
N$4
  Top 0.203: U1.45 44.34,16.24 45.15,15.43 45.07,15.43 Y1.1 45.3,15.33 46.62,16.65 C2.1
N$5
  Top 0.335: 42.61,22.99 42.61,26.4 A1.1 | C12.2 42.61,21.46 42.61,22.99 | 42.61,22.99 C13.1
N$6
  Top 0.203: U1.2 41.42,18.71
  Top 0.335: 41.42,18.71 41.42,19.94 | 41.42,19.94 L1.2 | 41.42,19.94 41.42,21.46 C12.1
N$7
  Top 0.203: U1.9 38.62,18.53 38.23,18.92 37.59,18.92 36.58,19.94 R3.1 36.33,21.34 R2.2
N$8
  Top 0.254: U5.19 26.8,12.31 26.54,12.57 26.54,14.67 23.89,17.32 U8.1
N$9  (via drill 0.25)
  Top 0.203: U5.20 26.03,11.63 24.57,13.08 24.57,15.49 v24.07,16
  Top 0.254: v26.23,19.81 U8.4
  Bottom 0.203: v26.23,19.81 24.07,17.65 v24.07,16
N$10  (via drill 0.25)
  Top 0.203: U6.8 14.86,22.61 10.03,17.78 v10.03,7.37 | v17.27,6.1 17.26,6.08 R4.2
  Top 0.254: R4.2 16,6.6 15.75,6.86 14.22,6.86 13.84,7.25 U3.9
  Bottom 0.203: v10.03,7.37 11.3,6.1 v17.27,6.1
N$11  (via drill 0.25)
  Top 0.254: U3.20 12.34,12.18 11.68,12.83 v11.68,16.26 | v17.84,19.81 U6.4
  Bottom 0.254: v11.68,16.26 11.68,16.83 14.67,19.81 v17.84,19.81
N$12
  Top 0.254: U6.1 15.51,19.06 12.57,16.13 12.57,12.76 12.84,12.5 U3.19
N$13  (via drill 0.25)
  Top 0.203: U7.8 18.99,22.61 v18.86,22.48 | v22.1,22.99 22.1,21.08 22.99,20.19 22.99,19.05 23.24,18.8 23.24,14.99 23.62,14.61 23.62,7.24 22.73,6.35 R5.2
  Top 0.254: R5.2 U4.9
  Bottom 0.203: v18.86,22.48 21.59,22.48 v22.1,22.99
N$14  (via drill 0.25)
  Top 0.254: U4.20 19.32,12.3 18.92,12.7 v18.92,16.83 | v22.04,19.81 U7.4
  Bottom 0.254: v18.92,16.83 18.92,17.54 U7.4 21.97,19.81 v22.04,19.81
N$15
  Top 0.254: U4.19 19.82,12.63 19.7,12.75 U7.1
N$16  (via drill 0.25)
  Top 0.203: U8.8 23.24,22.61 v23.05,22.42 | v27.37,21.91 30.59,18.69 30.59,7.55 29.38,6.34 R6.2
  Top 0.254: U5.9 R6.2
  Bottom 0.203: v23.05,22.42 26.86,22.42 v27.37,21.91
N$17
  Top 0.254: C15.1 12.83,6.08 Y2.3 12.84,6.18 U3.7
N$18
  Top 0.254: U3.6 12.34,7.51 11.68,6.86 11.68,5.46 11.18,4.95 11,4.95 Y2.1 8.94,4.53 C14.1
N$19
  Top 0.254: U4.17 20.82,12.06 21.14,12.38 21.53,12.38 21.84,12.7 21.84,13.22 R7.1
N$20
  Top 0.254: U5.17 27.8,12.12 28.07,12.38 28.51,12.38 28.83,12.7 28.83,13.22 R9.1
N$21
  Top 0.254: U3.17 13.84,12.12 14.03,12.32 14.54,12.32 14.86,12.64 14.86,13.22 R8.1
N$22
  cutout Route2: 42.16,27.94 42.16,26.16 46.1,26.16 46.1,27.94
  cutout Bottom: 42.16,27.94 42.16,26.16 46.1,26.16 46.1,27.94
  cutout Route15: 42.16,27.94 42.16,26.16 46.1,26.16 46.1,27.94
N$23
  Top 0.254: U11.8 4.46,10.81 4.06,10.41 4.06,9.51 R11.1 R12.2
N$24
  pour Top (no thermals): 2.54,21.08 4.95,21.08 4.95,20.7 4.38,20.7 4,20.32 2.54,20.32
N$25
  pour Top (no thermals): 33.15,32.51 33.15,30.1 32.77,30.1 32.77,30.61 32.38,30.99 32.38,32.51
N$26
  Top 0.508: J1.2 8.31,29.88 F1.P$1
N$27
  Top 0.254: U11.9 4.96,10.27 R10.1
N$28
  Top 0.508: D1.C 39.22,28.2 F2.P$1
N$29
  Top 0.254: D2.C R13.2
N$31  (via drill 0.25)
  Top 0.254: v11.18,33.53 9.53,33.53 R14.1
  Bottom 0.254: JUMPER1.P$2 11.68,32.64 11.18,33.15 v11.18,33.53
N$32
  Top 0.254: U11.16 8.5,13.59 C31.1
N$34  (via drill 0.25)
  Top 0.254: v15.11,32.64 12.19,35.56 R15.1
  Bottom 0.254: JUMPER2.P$2 v15.11,32.64
N$35  (via drill 0.25)
  Top 0.254: v18.67,32.64 13.46,37.85 R16.1
  Bottom 0.254: JUMPER3.P$2 v18.67,32.64
PROGRAM  (via drill 0.25)
  Top 0.203: U1.23 35.84,13.44 v35.69,13.59
  Top 0.254: v5.84,29.46 5.84,29.84 5.46,30.23 4.19,30.23 3.94,29.97 3.94,29.25 S1.2
  Bottom 0.203: v35.69,13.59 35.69,15.24 38.61,18.16 39.37,18.16 39.88,18.67 39.88,21.34 36.58,24.64
  Bottom 0.254: v5.84,29.46 10.92,34.54 24.13,34.54 31.11,27.56 35.05,27.56 36.58,26.04 36.58,24.64
RX  (via drill 0.25)
  Top 0.203: U11.21 5.46,15.88 v5.27,16.07 | U1.40 42.97,14.24 v43.31,13.91
  Bottom 0.203: v5.27,16.07 5.27,8.95 12.19,2.03 40.7,2.03 45.91,7.24 45.91,13.53 45.09,14.35 43.75,14.35 v43.31,13.91
SCK  (via drill 0.25)
  Top 0.203: U1.35 41.42,11.79 v41.72,11.49 | U3.12 15.94,9.27 v16.13,9.08 | U4.12 22.92,9.28 v23.11,9.08 | U5.12 29.9,9.28 v30.1,9.08
  Bottom 0.203: v16.13,9.08 v23.11,9.08 v30.1,9.08 30.16,9.08 30.35,9.27 31.11,9.27 31.88,10.03 31.88,10.92 33.08,12.13 41.08,12.13 v41.72,11.49
TX  (via drill 0.25)
  Top 0.203: U11.20 5.96,15.86 v6.16,16.07 | U1.41 43.15,14.64 v43.31,14.8
  Bottom 0.203: v6.16,16.07 5.65,15.56 5.65,9.27 12.38,2.54 40.45,2.54 44.39,6.48 44.32,7.87 45.34,8.89 45.34,12.26 44.32,13.27 42.99,13.27 42.67,13.59 42.67,14.16 v43.31,14.8
VBUS  (via drill 0.25)
  Top 0.254: v3.81,7.11 R11.2 | v35.94,31.88 D1.A | J2.1 36.99,34.07
  Top 0.508: 36.99,34.07 36.99,32 D1.A
  Bottom 0.254: v3.81,7.11 3.81,14.99 2.03,16.76 2.03,28.7 10.54,37.21 30.54,37.21 35.88,31.88 v35.94,31.88